# Altium schematic sheet V1_pwr_sply_noNegSply_sch.SchDoc
size A3; SheetNumber: 3; SheetTotal: 5; SPICEModelCacheNPPRCHHU: <root> / <DocumentId>NPPRCHHU</DocumentId> / <CacheFrame Number="0"> / <Model Name="875115552001_68uf" Kind="CKT"> / <Text>******* / .subckt 875115552001_68uF 1 2 / Rser 1 3 0.0109015046691 / Lser 2 4 4.507783507E-09 / C1 3 4 0.000068 / Rpar 3 4 73529.4117647059 / .ends 875115552001_68uF</Text> / </Model> / <Model Name="0805_885012107018_4.7uf" Kind="CKT"> / <Text>******* / .subckt 0805_885012107018_4.7uF 1 2 / Rser 1 3 0.00349429730952 / Lser 2 4 2.52123218E-10 / C1 3 4 0.0000047 / Rpar 3 4 20000000 / .ends 0805_885012107018_4.7uF</Text> / </Model> / <Model Name="6060_74439346100_10u" Kind="CKT"> / <Text>******* / .subckt 6060_74439346100_10u 1 2 / Rp 1 2 9786 / Cp 1 2 8.192p / Rs 1 N3 0.0265 / L1 N3 2 9.539u / .ends 6060_74439346100_10u</Text> / </Model> / </CacheFrame> / </root>
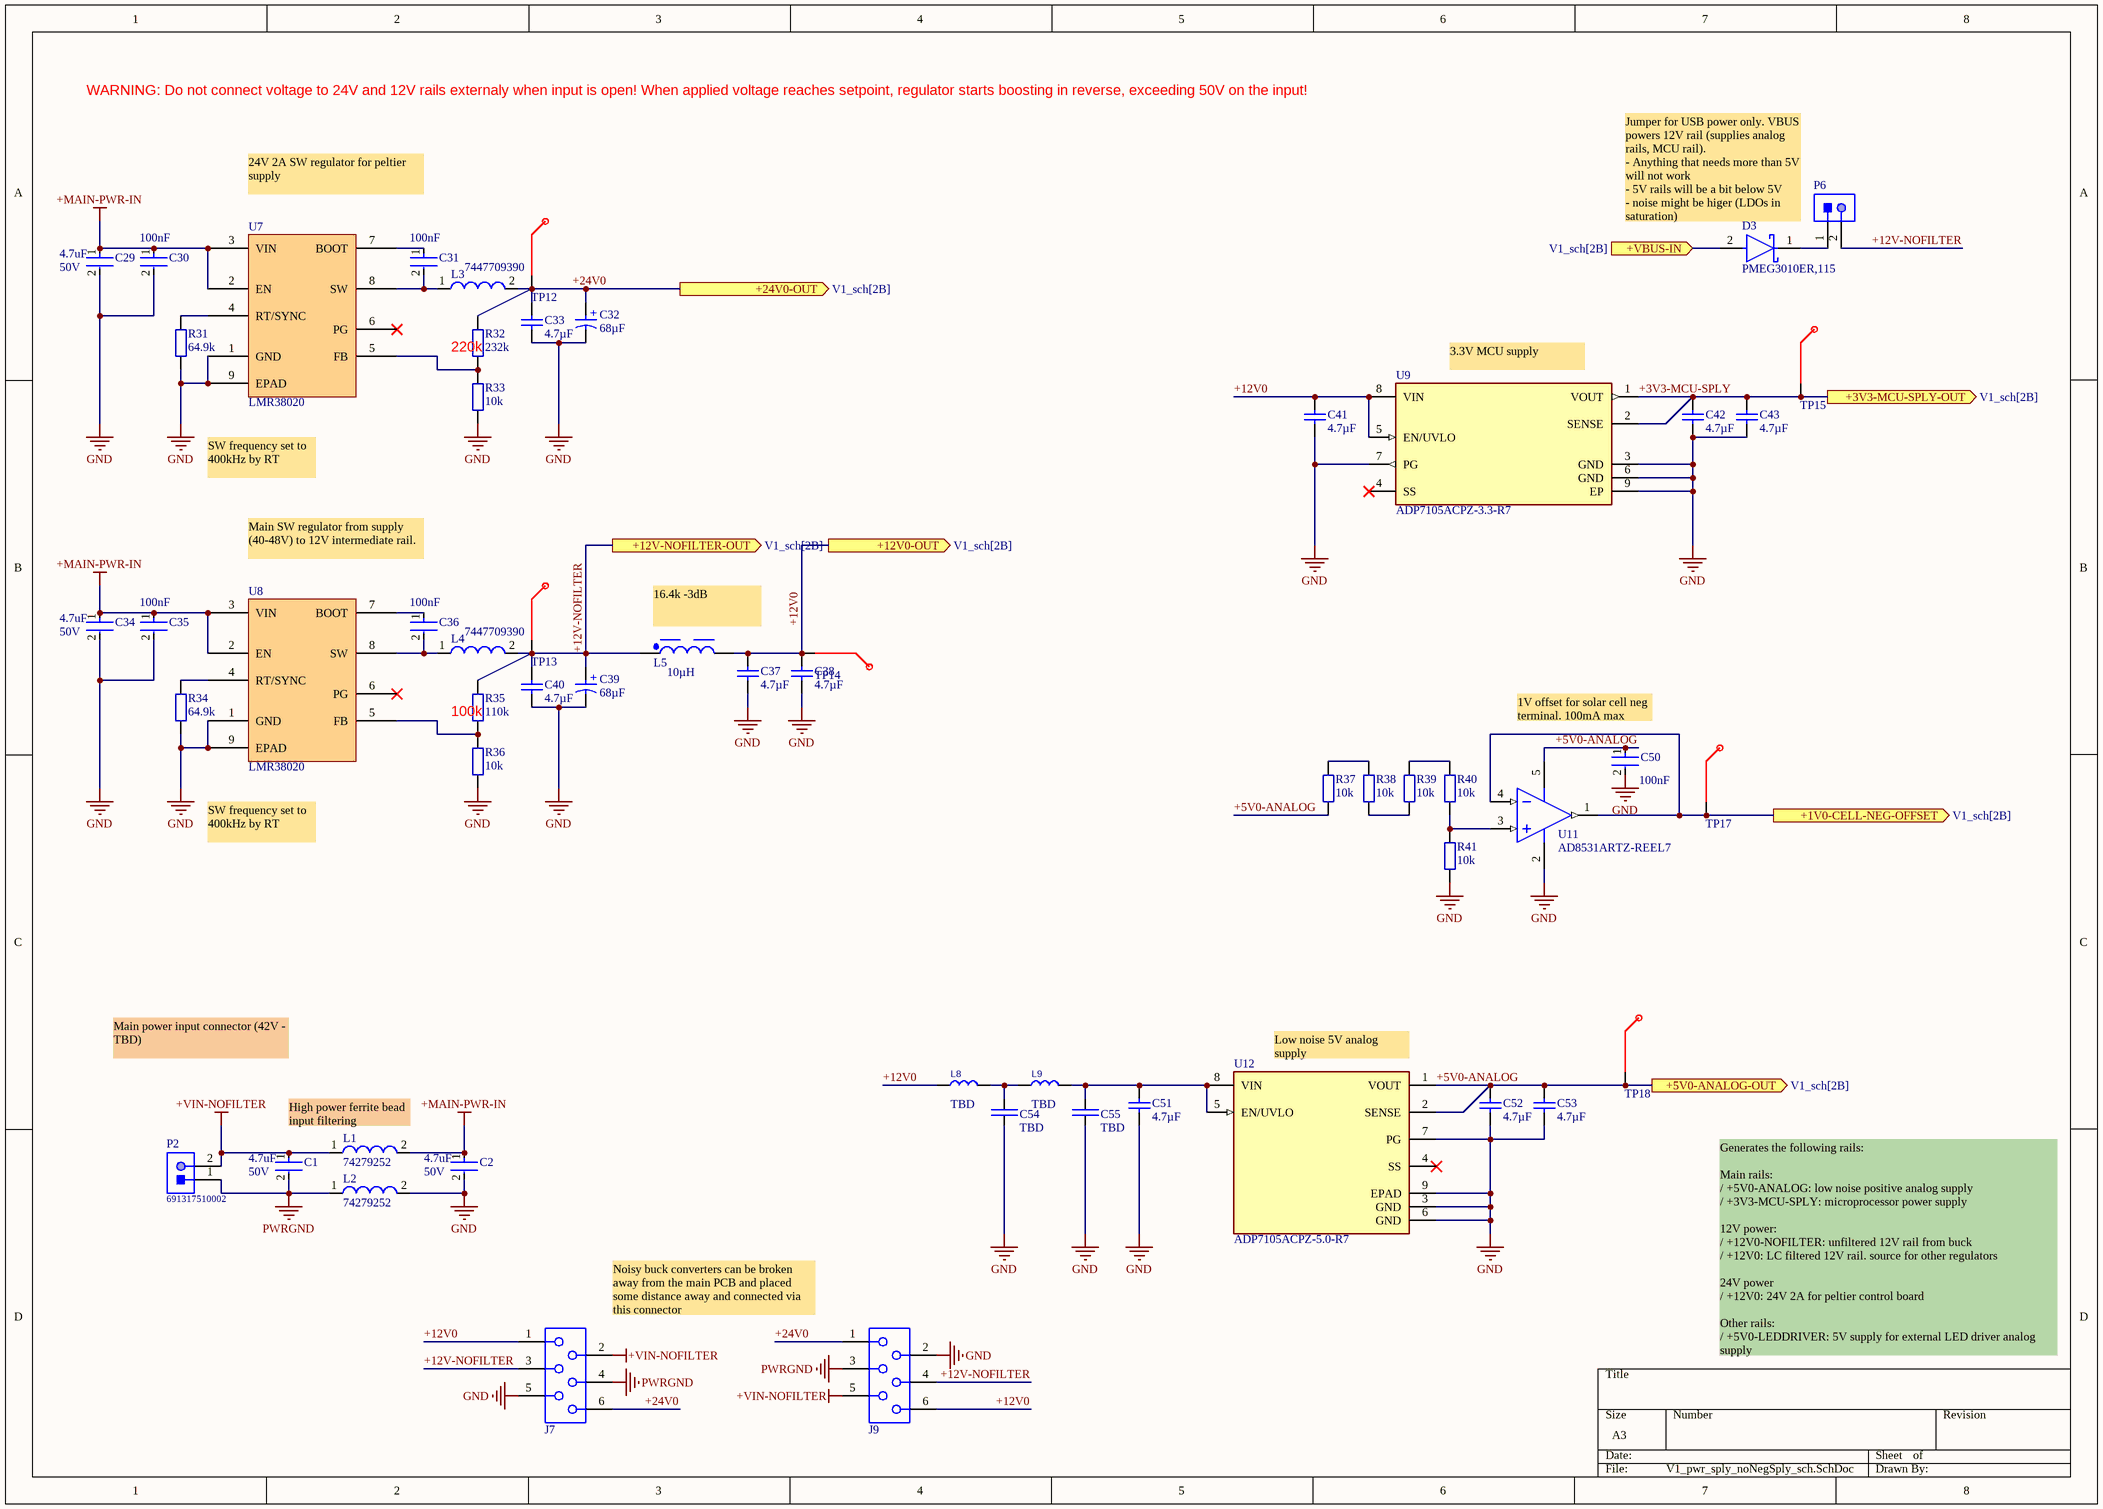
[diagram p0: V1_pwr_sply_noNegSply_sch.SchDoc]

## Parts
C1  Voltage Rating (DC): 50V  Capacitance: 4.7uF  [FP-885012208094-IPC_B]  (hidden comment: 885012208094)
C2  Voltage Rating (DC): 50V  Capacitance: 4.7uF  [FP-885012208094-IPC_B]  (hidden comment: 885012208094)
C29  Voltage Rating (DC): 50V  Capacitance: 4.7uF  [FP-885012208094-IPC_B]  (hidden comment: 885012208094)
C30  Capacitance: 100nF  [FP-885012206095-IPC_B]  (hidden comment: 885012206095)
C31  Capacitance: 100nF  [FP-885012206095-IPC_B]  (hidden comment: 885012206095)
C32  Capacitance: 68µF  [WCAP-PSHP_D8H8.7]  (hidden comment: 875115552001)
C33  Capacitance: 4.7µF  [WCAP-CSGP_0805_L2W1.25H1.25]  (hidden comment: 885012107018)
C34  Voltage Rating (DC): 50V  Capacitance: 4.7uF  [FP-885012208094-IPC_B]  (hidden comment: 885012208094)
C35  Capacitance: 100nF  [FP-885012206095-IPC_B]  (hidden comment: 885012206095)
C36  Capacitance: 100nF  [FP-885012206095-IPC_B]  (hidden comment: 885012206095)
C37  Capacitance: 4.7µF  [WCAP-CSGP_0805_L2W1.25H1.25]  (hidden comment: 885012107018)
C38  Capacitance: 4.7µF  [WCAP-CSGP_0805_L2W1.25H1.25]  (hidden comment: 885012107018)
C39  Capacitance: 68µF  [WCAP-PSHP_D8H8.7]  (hidden comment: 875115552001)
C40  Capacitance: 4.7µF  [WCAP-CSGP_0805_L2W1.25H1.25]  (hidden comment: 885012107018)
C41  Capacitance: 4.7µF  [WCAP-CSGP_0805_L2W1.25H1.25]  (hidden comment: 885012107018)
C42  Capacitance: 4.7µF  [WCAP-CSGP_0805_L2W1.25H1.25]  (hidden comment: 885012107018)
C43  Capacitance: 4.7µF  [WCAP-CSGP_0805_L2W1.25H1.25]  (hidden comment: 885012107018)
C50  Capacitance: 100nF  [FP-885012206095-IPC_B]  (hidden comment: 885012206095)
C51  Capacitance: 4.7µF  [WCAP-CSGP_0805_L2W1.25H1.25]  (hidden comment: 885012107018)
C52  Capacitance: 4.7µF  [WCAP-CSGP_0805_L2W1.25H1.25]  (hidden comment: 885012107018)
C53  Capacitance: 4.7µF  [WCAP-CSGP_0805_L2W1.25H1.25]  (hidden comment: 885012107018)
C54  value TBD  [FPR_0603_C_R0]  (hidden comment: PN_C0603_TBD)
C55  value TBD  [FPR_0603_C_R0]  (hidden comment: PN_C0603_TBD)
D3  PMEG3010ER,115  [FP-SOD123W-MFG]
J7  690368190672  [690368190672]  (value not drawn)
J9  690368190672  [690368190672]  (value not drawn)
L1  74279252  [SMD-1812]
L2  74279252  [SMD-1812]
L3  7447709390  [WE-PD-XXL]
L4  7447709390  [WE-PD-XXL]
L5  Inductance: 10µH  [WE-XHMI_6060_L6.65W6.45H5.8]  (hidden comment: 74439346100)
L8  value TBD  [FPR_1216_R_R0]  (hidden comment: L-TBD)
L9  value TBD  [FPR_1216_R_R0]  (hidden comment: L-TBD)
P2  691317510002  [691317510002]
P6  61300211121  [61300211121]  (value not drawn)
R31  value 64.9k  [FPR_0603_R_R0]  (hidden comment: PN_R0603_64k9)
R32  value 232k  [FPR_0603_R_R0]  (hidden comment: PN_R0603_232k)
R33  value 10k  [FPR_0603_R_R0]  (hidden comment: PN_R0603_10k)
R34  value 64.9k  [FPR_0603_R_R0]  (hidden comment: PN_R0603_64k9)
R35  value 110k  [FPR_0603_R_R0]  (hidden comment: PN_R0603_110k)
R36  value 10k  [FPR_0603_R_R0]  (hidden comment: PN_R0603_10k)
R37  value 10k  [FPR_0603_R_R0]  (hidden comment: PN_R0603_10k)
R38  value 10k  [FPR_0603_R_R0]  (hidden comment: PN_R0603_10k)
R39  value 10k  [FPR_0603_R_R0]  (hidden comment: PN_R0603_10k)
R40  value 10k  [FPR_0603_R_R0]  (hidden comment: PN_R0603_10k)
R41  value 10k  [FPR_0603_R_R0]  (hidden comment: PN_R0603_10k)
TP12  Test Point  [Test Point 1.5mm SMD]  (value not drawn)
TP13  Test Point  [Test Point 1.5mm SMD]  (value not drawn)
TP14  Test Point  [Test Point 1.5mm SMD]  (value not drawn)
TP15  Test Point  [Test Point 1.5mm SMD]  (value not drawn)
TP17  Test Point  [Test Point 1.5mm SMD]  (value not drawn)
TP18  Test Point  [Test Point 1.5mm SMD]  (value not drawn)
U7  LMR38020  [LMR38020-footprint]
U8  LMR38020  [LMR38020-footprint]
U9  ADP7105ACPZ-3.3-R7  [FP-CP-8-5-IPC_C]
U11  AD8531ARTZ-REEL7  [ADI-RJ-5_M]
U12  ADP7105ACPZ-5.0-R7  [FP-CP-8-5-IPC_C]

## Ports
+1V0-CELL-NEG-OFFSET (out, see V1_sch[2B]), +3V3-MCU-SPLY-OUT (out, see V1_sch[2B]), +5V0-ANALOG-OUT (out, see V1_sch[2B]), +12V0-OUT (out, see V1_sch[2B]), +12V-NOFILTER-OUT (out, see V1_sch[2B]), +24V0-OUT (out, see V1_sch[2B]), +VBUS-IN (in, see V1_sch[2B])

## Nets
+MAIN-PWR-IN: C2.1 C29.1 C30.1 C34.1 C35.1 L1.2 U7.2(EN) U7.3(VIN) U8.2(EN) U8.3(VIN)
+VIN-NOFILTER: C1.1 J7.2 J9.5 L1.1 P2.2
GND: C2.2 C29.2 C30.2 C32.2(N) C33.1 C34.2 C35.2 C37.1 C38.1 C39.2(N) C40.1 C41.1 C42.1 C43.1 C50.2 C51.1 C52.1 C53.1 C54.1 C55.1 J7.5 J9.2 L2.2 R31.1 R33.1 R34.1 R36.1 R41.1 U7.1(GND) U7.9(EPAD) U8.1(GND) U8.9(EPAD) U9.3(GND) U9.6(GND) U9.7(PG) U9.9(EP) U11.2(-V) U12.3(GND) U12.6(GND) U12.7(PG) U12.9(EPAD)
PWRGND: C1.2 J7.4 J9.3 L2.1 P2.1
+1V0-CELL-NEG-OFFSET: TP17.1 U11.1(OUT_A) U11.4(-IN_A) ; port +1V0-CELL-NEG-OFFSET
+3V3-MCU-SPLY: C42.2 C43.2 TP15.1 U9.1(VOUT) U9.2(SENSE) ; port +3V3-MCU-SPLY-OUT
+5V0-ANALOG: C50.1 C52.2 C53.2 R37.1 TP18.1 U11.5(+V) U12.1(VOUT) U12.2(SENSE) ; port +5V0-ANALOG-OUT
+12V0: C37.2 C38.2 C41.2 J7.1 J9.6 L5.2 L8.1 TP14.1 U9.5(EN/UVLO) U9.8(VIN) ; port +12V0-OUT
+12V-NOFILTER: C39.1(P) C40.2 J7.3 J9.4 L4.2 L5.1 P6.2 R35.2 TP13.1 ; port +12V-NOFILTER-OUT
+24V0: C32.1(P) C33.2 J7.6 J9.1 L3.2 R32.2 TP12.1 ; port +24V0-OUT
+VBUS-IN: D3.2(A) ; port +VBUS-IN
NetC31_1: C31.1 U7.7(BOOT)
NetC31_2: C31.2 L3.1 U7.8(SW)
NetC36_1: C36.1 U8.7(BOOT)
NetC36_2: C36.2 L4.1 U8.8(SW)
NetC51_2: C51.2 C55.2 L9.2 U12.5(EN/UVLO) U12.8(VIN)
NetC54_2: C54.2 L8.2 L9.1
NetD3_1: D3.1(C) P6.1
NetR31_2: R31.2 U7.4(RT/SYNC)
NetR32_1: R32.1 R33.2 U7.5(FB)
NetR34_2: R34.2 U8.4(RT/SYNC)
NetR35_1: R35.1 R36.2 U8.5(FB)
NetR37_2: R37.2 R38.2
NetR38_1: R38.1 R39.1
NetR39_2: R39.2 R40.2
NetR40_1: R40.1 R41.2 U11.3(+IN_A)

Not connected (* = marked no-connect by the designer): U7 6(PG)*; U8 6(PG)*; U9 4(SS)*; U12 4(SS)*

## Notes on the sheet
- WARNING: Do not connect voltage to 24V and 12V rails externaly when input is open! When applied voltage reaches setpoint, regulator starts boosting in reverse, exceeding 50V on the input!
- 24V 2A SW regulator for peltier supply
- Jumper for USB power only. VBUS powers 12V rail (supplies analog rails, MCU rail).
  - Anything that needs more than 5V will not work
  - 5V rails will be a bit below 5V
  - noise might be higer (LDOs in saturation)
- (near R32) 220k
- (near U9) 3.3V MCU supply
- SW frequency set to 400kHz by RT
- Main SW regulator from supply (40-48V) to 12V intermediate rail.
- 16.4k -3dB
- (near R35) 100k
- (near C50) 1V offset for solar cell neg terminal. 100mA max
- Main power input connector (42V - TBD)
- (near U12) Low noise 5V analog supply
- High power ferrite bead input filtering
- Noisy buck converters can be broken away from the main PCB and placed some distance away and connected via this connector
- Generates the following rails:
  Main rails:
  / +5V0-ANALOG: low noise positive analog supply
  / +3V3-MCU-SPLY: microprocessor power supply
  12V power:
  / +12V0-NOFILTER: unfiltered 12V rail from buck
  / +12V0: LC filtered 12V rail. source for other regulators
  24V power
  / +12V0: 24V 2A for peltier control board
  Other rails:
  / +5V0-LEDDRIVER: 5V supply for external LED driver analog supply
  / +1V0-CELL-NEG-OFFSET: offset for solar cell neg termianls
- (in symbol 875115552001) +

## Library data of the parts
C1 C2 C29 C34 = CMP-207839-000019-1: CAP CER 4.7UF 50V X7R 1206; Tolerance: 10%; Mount: Surface Mount; Width: 0.063inch; Min Operating Temperature: -55°C; RoHS Compliant: Yes; Dielectric: X7R; Series: WCAP-CSGP; Case Code (Metric): 3216; Case/Package: 1206; Max Operating Temperature: 125°C; Thickness: 0.075inch; Packaging: Cut Tape; Length: 0.126inch; Voltage Rating: 50V; Case Code (Imperial): 1206
C30 C31 C35 C36 C50 = CMP-207839-000004-1: CAP CER 0.1UF 50V X7R 0603; Tolerance: 10%; RoHS Compliant: Yes; Thickness: 0.037inch; Voltage Rating: 50V; Packaging: Cut Tape; Dielectric: X7R; Series: WCAP-CSGP; Width: 0.031inch; Max Operating Temperature: 125°C; Min Operating Temperature: -55°C; Case/Package: 0603; Case Code (Metric): 1608; Case Code (Imperial): 0603; Length: 0.063inch; Mount: Surface Mount; Voltage Rating (DC): 50V
C32 C39 = 875115552001: WCAP-PSHP Aluminum Polymer Capacitor, V-Chip, SMT, D8 x H8.7mm, 68µF, 25V; Manufacturer: Wurth Elektronik; Capacitance Tolerance: +/-20%; Dissipation Factor: 8%; Endurance: 2000h; ESR: 20mΩ; Leakage Current: 340µA; Ripple Current: 3500mA; Technical Reference: PSEE087680M025DVCTEB000; Manufacturer Part Number: 875115552001; Category: Aluminum Polymer Capacitors; Match Code: WCAP-PSHP; ComponentLink1Description: Website Link; ComponentLink1URL: https://www.we-online.com/redexpert/article/875115552001?ad; ComponentLink2Description: Datasheet Link; ComponentLink2URL: https://www.we-online.com/redexpert/spec/875115552001?ad; Mount: Surface Mount; Operating Temperature Max: 105°C; Operating Temperature Min: -55°C; Packaging: Tape and Reel; Height: 8.7mm; Diameter: 8mm; Rated Voltage (DC): 25V
C33 C37 C38 C40-C43 C51-C53 = 885012107018: WCAP-CSGP Multilayer Ceramic Chip Capacitor, General Purpose, size 0805, X5R, 4.7µF, 25VDC; Manufacturer: Wurth Elektronik; Case/Size Code: 0805; Capacitance Tolerance: +/-20%; Dissipation Factor: 10%; Insulation Resistance: 0.02GΩ; Rated Voltage (DC): 25V; Technical Reference: X5R0805475M025DFCT10000; Manufacturer Part Number: 885012107018; Category: Multilayer Ceramic Chip Capacitors; Match Code: WCAP-CSGP; ComponentLink1Description: Website Link; ComponentLink1URL: https://www.we-online.com/redexpert/article/885012107018?ad; ComponentLink2Description: Datasheet Link; ComponentLink2URL: https://www.we-online.com/redexpert/spec/885012107018?ad; Mount: Surface Mount; Operating Temperature Max: 85°C; Operating Temperature Min: -55°C; Packaging: Tape and Reel; Length: 2mm; Width: 1.25mm; Height: 1.25mm; Ceramic Type: X5R
C54 C55 = C: Capacitor - generic SMD
D3 = CMP-14398-000036-1: DIODE SCHOTTKY 30V 1A CFP3; RoHS Compliant: Yes
J7 J9 = 690368190672: WR-MM Mini Module Connector, Female, THT, with Latch & Polarization, Angled, pitch 2.54mm, 6p; Manufacturer: Wurth Elektronik; Contact Resistance: 10mΩ; Insulation Resistance: 1000MΩ; Rated Current: 1.5A; Working Voltage: 250VAC; Withstanding Voltage: 500VAC; ComponentLink1Description: Website Link; ComponentLink1URL: https://www.we-online.com/redexpert/article/690368190672?ad; ComponentLink2Description: Datasheet Link; ComponentLink2URL: https://www.we-online.com/redexpert/spec/690368190672?ad; Manufacturer Part Number: 690368190672; Category: Board-to-Board Connectors; Match Code: WR-MM; Mount: Through Hole; Operating Temperature Max: 105°C; Operating Temperature Min: -40°C; Packaging: Tube; Length: 12.22mm; Gender: Female; Number of Pins: 6; Orientation: Angled; Pitch: 2.54mm
L1 L2 = CMP-0220-00090-1: SMD EMI Suppression Ferrite Bead WE-CBF, Z = 680 Ohm; Impedance: 680 Ohm; ComponentLink1Description: Manufacturer Link; ComponentLink2URL: http://www.we-online.de/katalog/media/pdf/74279252.pdf; PackageReference: SMD-1812; PackageVersion: 2010; PackageDescription: Chip Inductor, 2-Leads, Body 4.5 x 3.2 mm; ComponentLink1URL: http://www.we-online.com; ComponentLink2Description: Datasheet; DatasheetVersion: ver 7, May-2010
L3 L4 = CMP-0227-00184-1: SMD-Shielded Power Inductor WE-PD, L = 39.0 µH; Inductance: 39.0 ÂµH; ComponentLink2Description: Datasheet; PackageDescription: SMD Inductor, 2-Leads, Body 12.0 x 12.0 mm; PackageVersion: 2004; ComponentLink2URL: http://www.we-online.de/katalog/media/pdf/7447709390.pdf; DatasheetVersion: ver 2, Jun-2006; ComponentLink1URL: http://www.we-online.com; ComponentLink1Description: Manufacturer Link; PackageReference: WE-PD-XXL
L5 = 74439346100: WE-XHMI SMT Power Inductor, size 6060, 10µH, 5A, 26.5mΩ; Manufacturer: Wurth Elektronik; Case/Size Code: 6060; Performance Rated Current: 6.4A; Saturation Current: 9.7A; Self Resonant Frequency: 18MHz; Manufacturer Part Number: 74439346100; Category: Shielded Power Inductors; Match Code: WE-XHMI; ComponentLink1Description: Website Link; ComponentLink1URL: https://www.we-online.com/redexpert/article/74439346100?ad; ComponentLink2Description: Datasheet Link; ComponentLink2URL: https://www.we-online.com/redexpert/spec/74439346100?ad; Mount: Surface Mount; Operating Temperature Max: 125°C; Operating Temperature Min: -40°C; Packaging: Tape and Reel; Length: 6.65mm; Width: 6.45mm; Height: 5.8mm; DC Resistance: 26.5mΩ; Rated Current: 5A
L8 L9 = L: Inductor - generic SMD
P2 = CMP-1502-02238-1: Serie 3175 - 5.08mm Close Horizontal PCB Header with Flages WR-TBL, 2 pin; Manufacturer: Wurth Elektronik; Pin Number: 2; Gender: Male; Pitch: 5.08mm; Publisher: WurthElektronik; Part Number: 691317510002; Manufacturer URL: http://www.we-online.de; Package Reference: 691317510002; Mounting Technology: THT; Datasheet URL: http://katalog.we-online.de/em/datasheet/6913175100xx.pdf; Operating Temperature: -40to105degC; Packaging: Box
P6 = CMP-1712-00002-4: THT Vertical Pin Header WR-PHD, Pitch 2.54 mm, Single Row, 2 pins; Manufacturer: Wurth Elektronik; Rated Current: 3A; Gender: Male; Withstanding Voltage: 500VAC; Working Voltage: 250VAC; Pitch: 2.54mm; Contact Resistance: 20mOhm; Pin Number: 2; Mounting Technology: THT; Orientation: Vertical; Operating Temperature: -40to105degC; Packaging: Bag; Publisher: WurthElektronik; Datasheet URL: https://katalog.we-online.de/em/datasheet/6130xx11121.pdf; Manufacturer URL: http://www.we-online.de; Row Number: Single; Package Reference: 61300211121; Part Number: 61300211121
R31-R41 = R: Resistor - generic SMD
U7 U8 = LMR38020: LMR38020 SIMPLE SWITCHER® 4.2-V to 80-V, 2-A Synchronous Buck Converter with 40-µA IQ
U9 = CMP-09138-000177-1: IC REG LINEAR 3.3V 500MA 8LFCSP; Max Input Voltage: 20V; Max Output Voltage: 19V; Power Supply Rejection Ratio (PSRR): 50dB; Max Supply Current: 900uA; Min Output Voltage: 1.22V; Max Operating Temperature: 125°C; Min Operating Temperature: -40°C; RoHS Compliant: Yes; Min Input Voltage: 3.3V; Max Output Current: 500mA; Number of Pins: 8
U11 = CMP-0384-01486-1: Single Channel RRIO Operational Amplifier, 3 MHz BW, 5 V/us SR, Industrial, 5-pin SOT23 (RJ-5), Reel; Manufacturer: Analog Devices; Generic Part Number: AD8531; Input Bias Current: 5pA; Iq/Amp: 1.25mA; Amplifiers Per Package: 1; V Span Min: 2.7V; Slew Rate: 5V/us; V Span Max: 6V; Input Offset Voltage: 25mV; Small Signal Bandwidth: 3MHz; ComponentLink3Description: Package Specification; ComponentLink1URL: http://www.analog.com/en/index.html; DatasheetVersion: Rev. F; ComponentLink3URL: http://www.analog.com/static/imported-files/packages/PKG_PDF/SOT-23(RJ)/RJ_5.pdf; ComponentLink2URL: http://www.analog.com/static/imported-files/data_sheets/AD8531_8532_8534.pdf; ComponentLink2Description: Datasheet; ComponentLink1Description: Manufacturer URL; Code_JEDEC: MO-178-AA; PackageReference: RJ-5; PartNumber: AD8531ARTZ-REEL7; PackageDescription: 5-Pin Small Outline Transistor Package, Body 2.9 x 1.6 mm, Pitch 0.95 mm; Packing: Reel; Mounting Technology: Surface Mount; PackageVersion: 121608-A
U12 = CMP-09138-000117-1: IC REG LINEAR 5V 500MA 8LFCSP; Polarity: Positive; Power Supply Rejection Ratio (PSRR): 50dB; Min Output Voltage: 1.22V; Quiescent Current: 900uA; Number of Regulators: 1; Min Input Voltage: 3.3V; Dropout Voltage: 350mV; Min Current Limit: 625mA; Max Input Voltage: 20V; Reference Voltage: 1.23V; Operating Supply Current: 900mA; Max Output Voltage: 19V; Output Type: Fixed; Accuracy: 0.8%; Output Current: 500mA; Max Output Current: 500mA; Number of Outputs: 1; Max Supply Current: 900uA; Number of Pins: 8; Output Voltage: 5V; Package Quantity: 1500; RoHS Compliant: Yes; Lead Free: Contains Lead; Packaging: Tape and Reel; Max Operating Temperature: 125°C; Mount: Surface Mount; Min Operating Temperature: -40°C; Contact Plating: Tin